# EasyEDA Pro project CustomDevKit.epro, schematic SimWheelKit_unified_REV2

## Sheets
1 CPU: Board Name: SimwheelKit_unified_REV2; Create Date: 2025-08-03; Page Name: CPU; Project Name: SimWheelKit_ESP32_unified; Schematic Name: SimWheelKit_unified_REV2; Update Date: 2025-08-04; Company: ESP32SimWheel; Drawn: Afpineda; Page Size: A4; Version: REV2
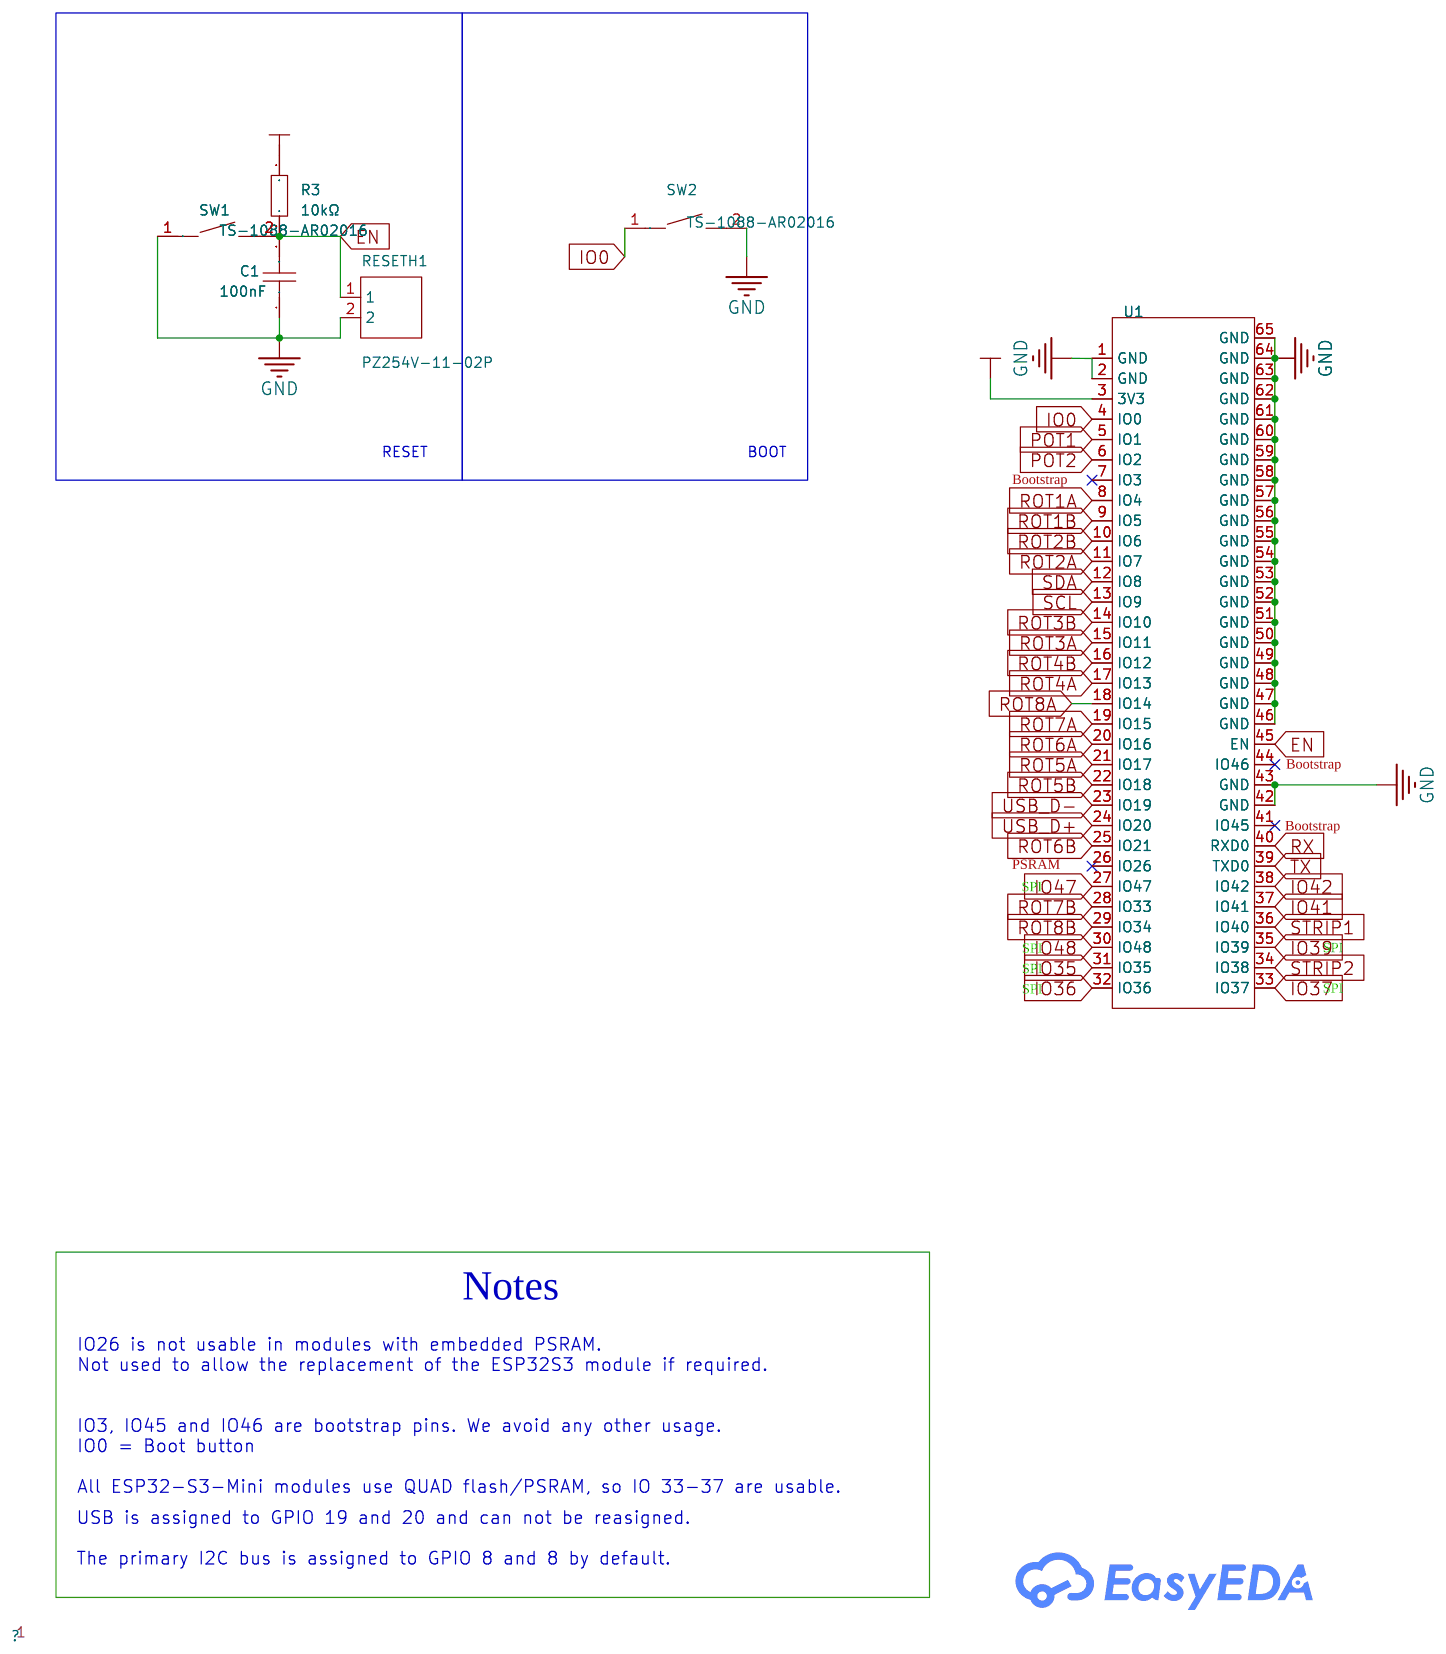
[diagram p0: CPU]
2 Connectors: Page Name: Connectors
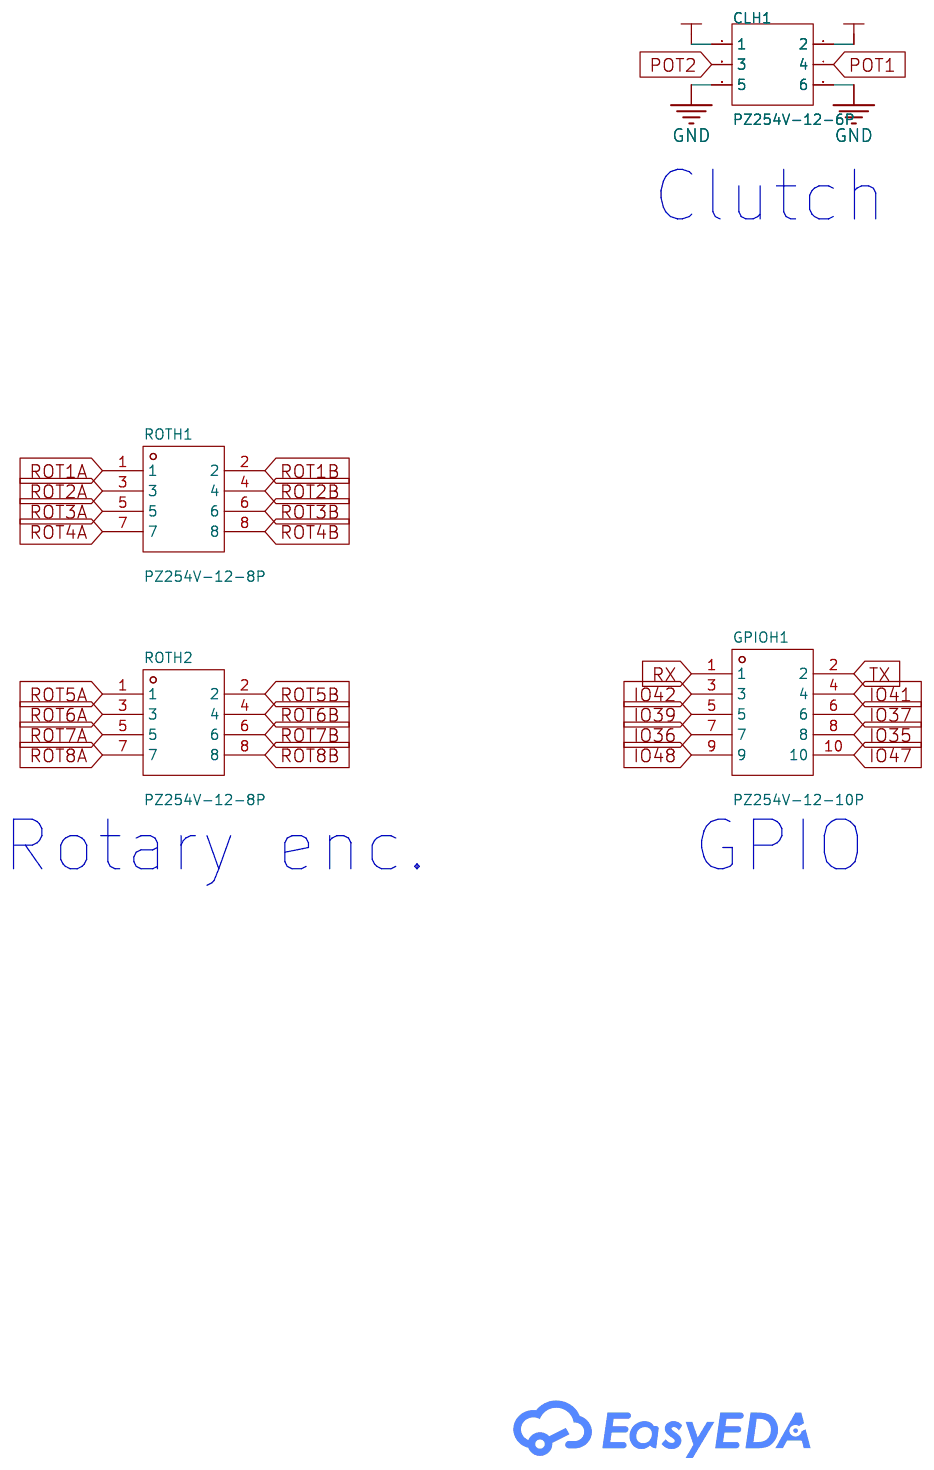
[diagram p1: Connectors]
3 Power: Page Name: Power
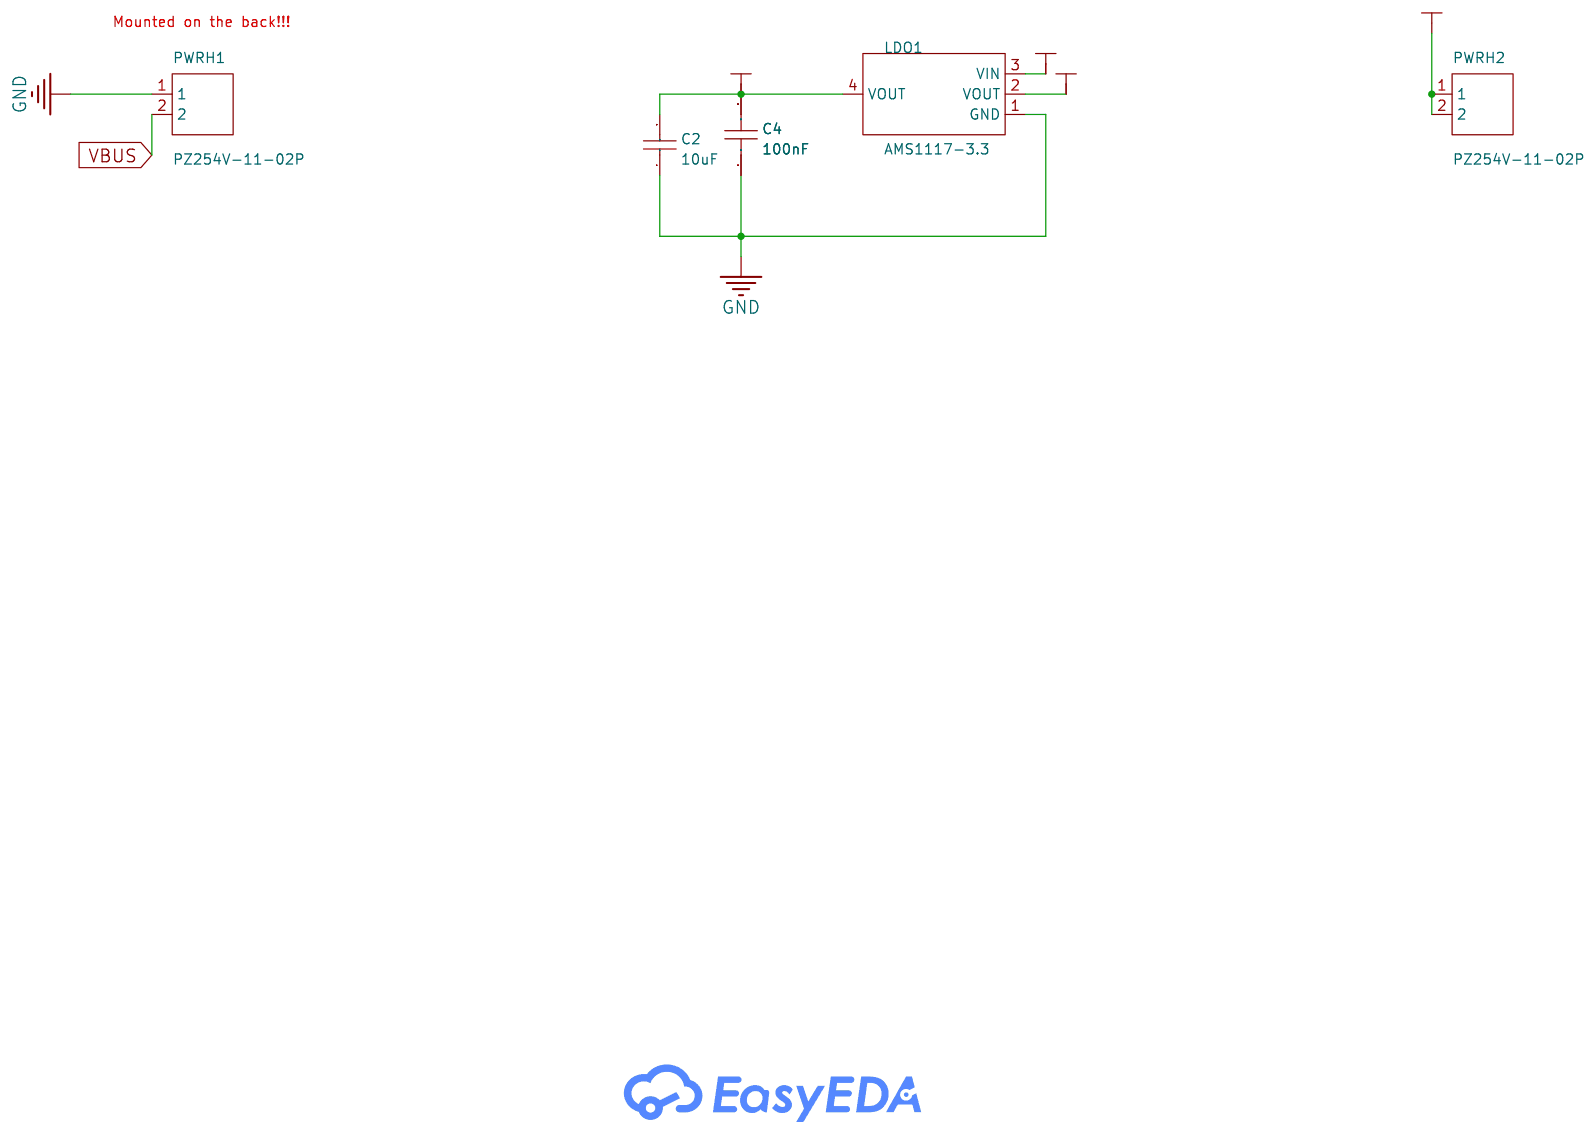
[diagram p2: Power]
4 LED strips: Page Name: LED strips; Company: EasyEDA.com
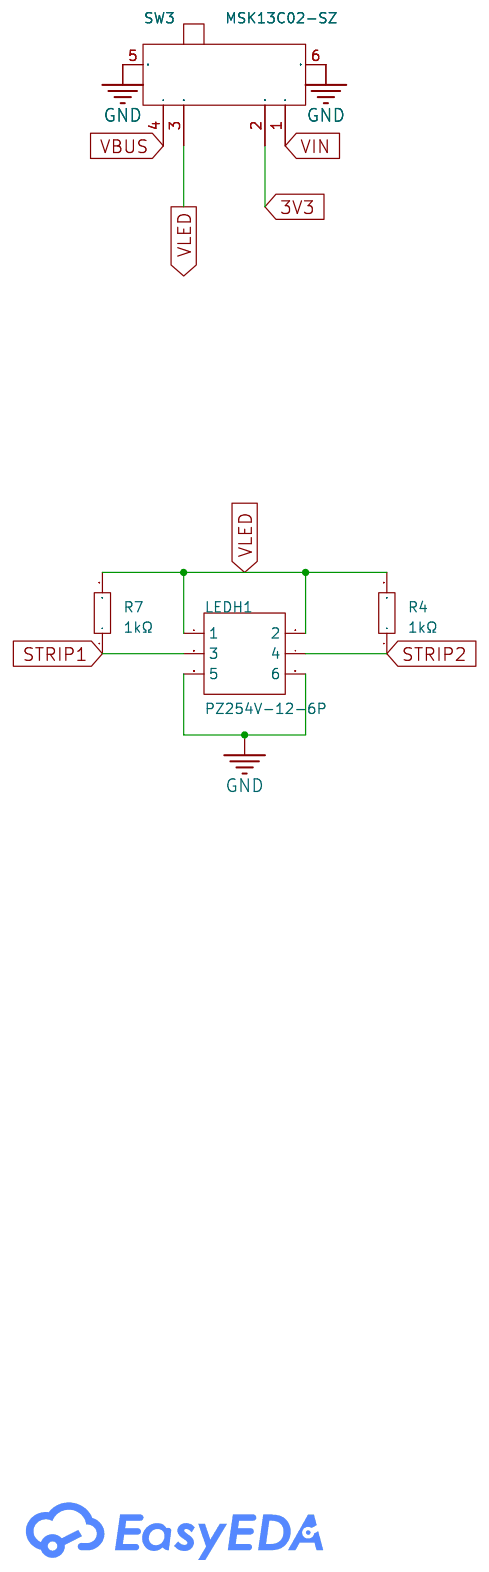
[diagram p3: LED strips]
5 USB: Page Name: USB; Update Date: 2025-08-03; Company: EasyEDA.com
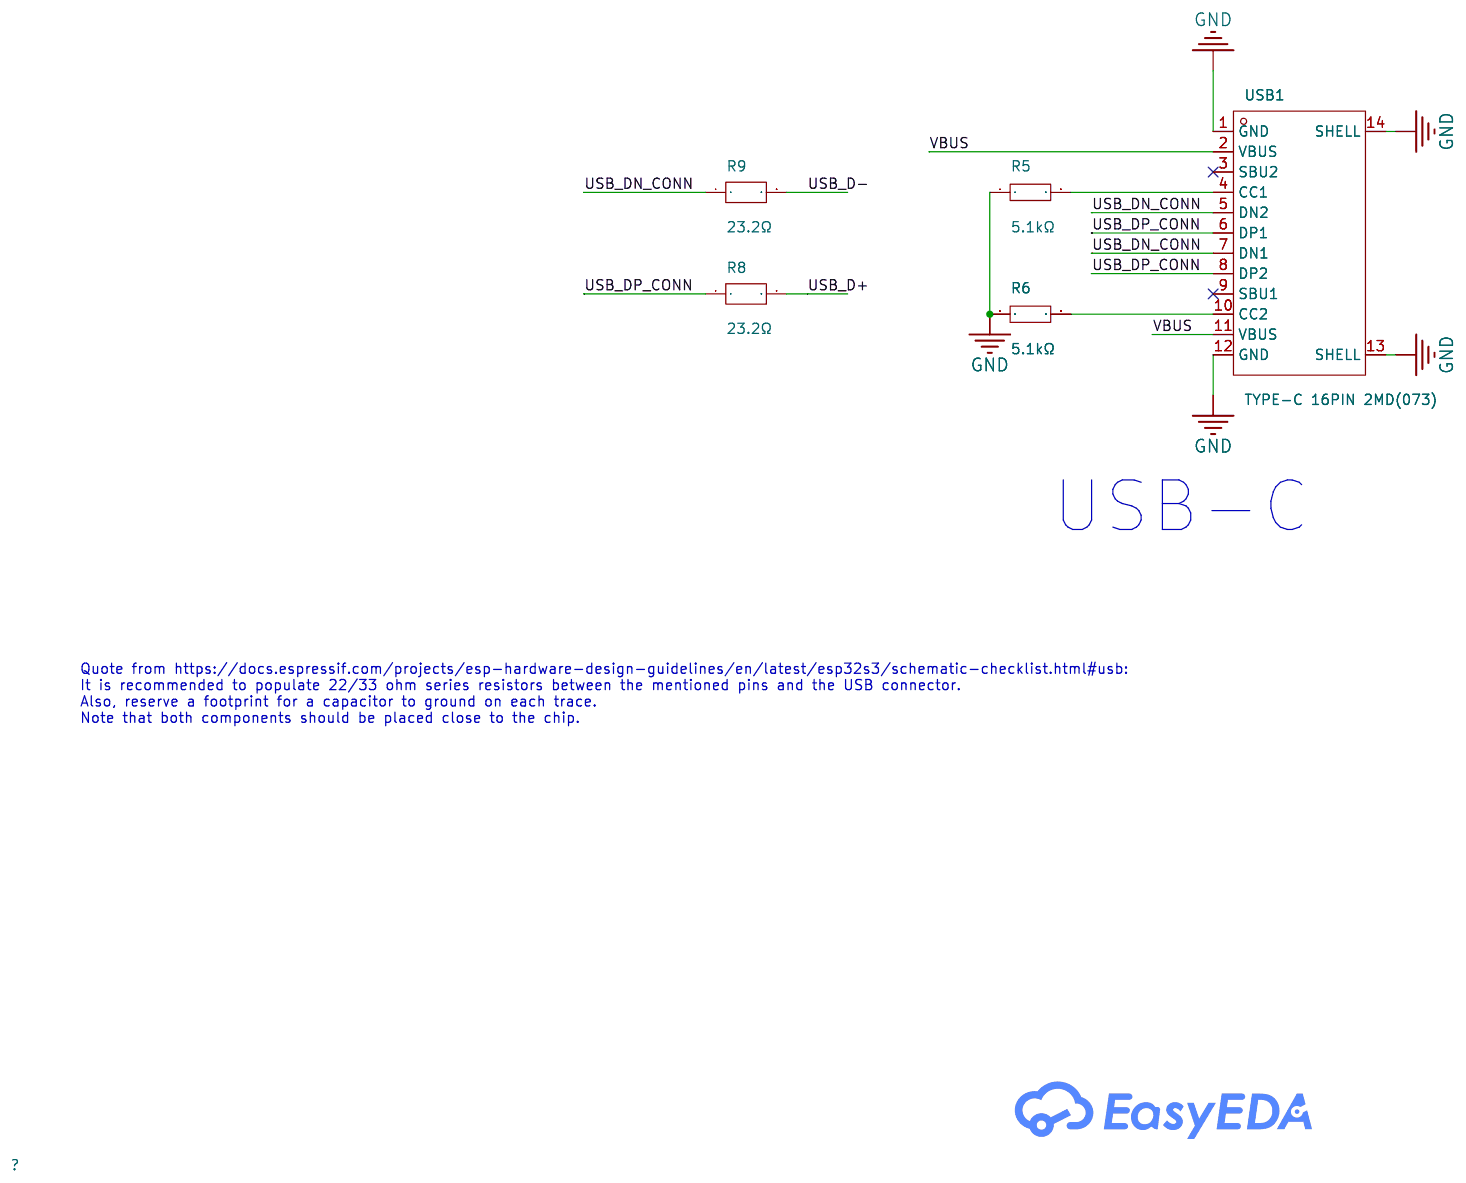
[diagram p4: USB]
6 Ground: Page Name: Ground; Update Date: 2025-08-20; Company: EasyEDA.com
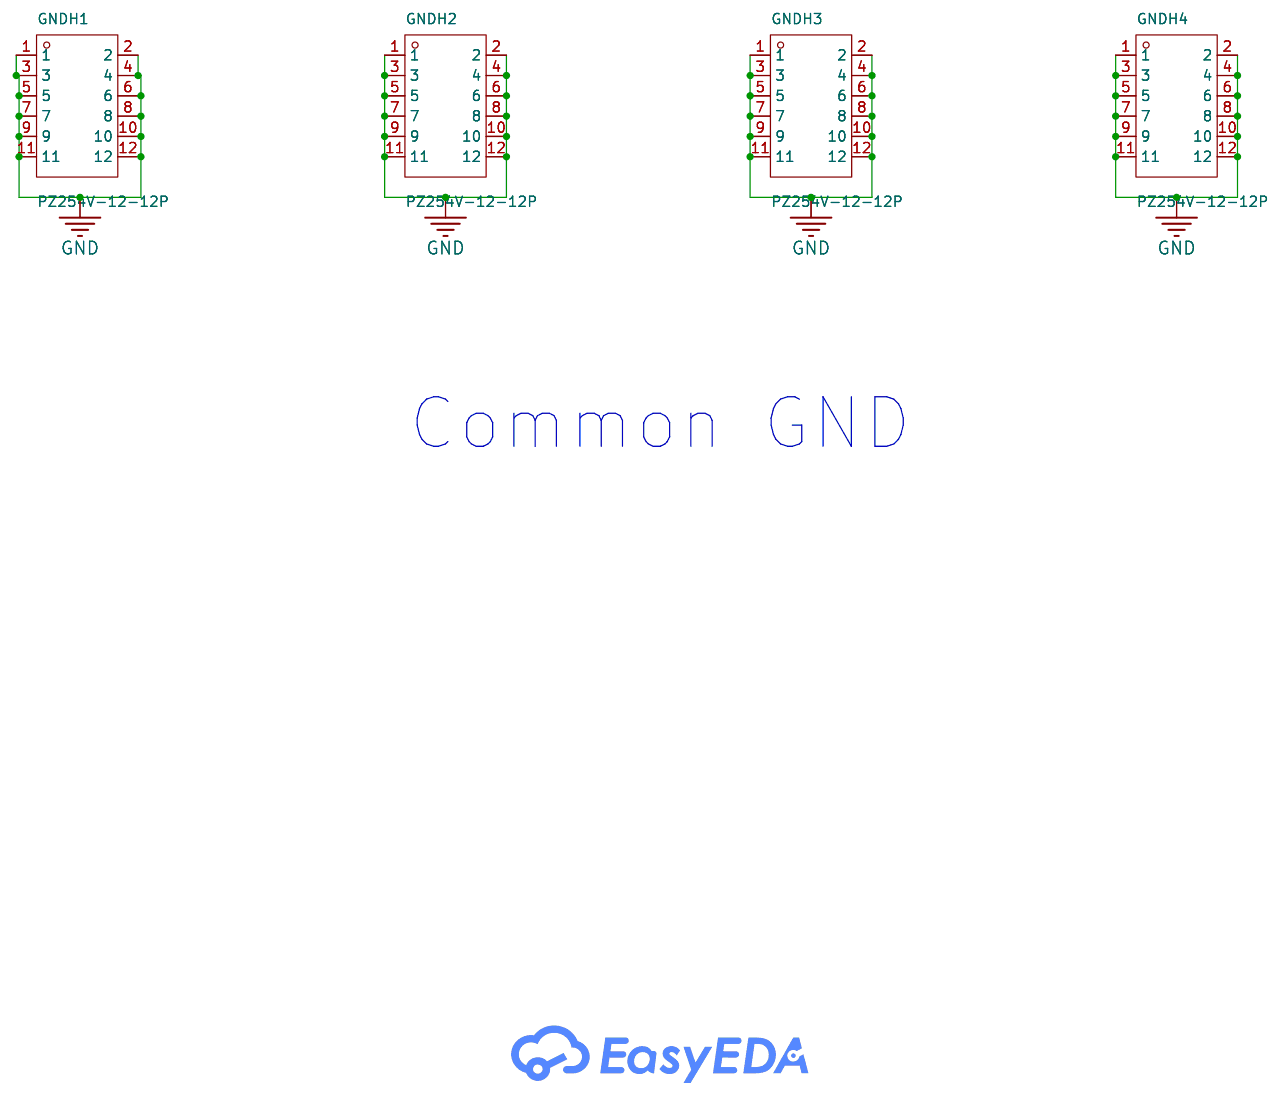
[diagram p5: Ground]
7 Battery: Page Name: Battery; Company: EasyEDA.com
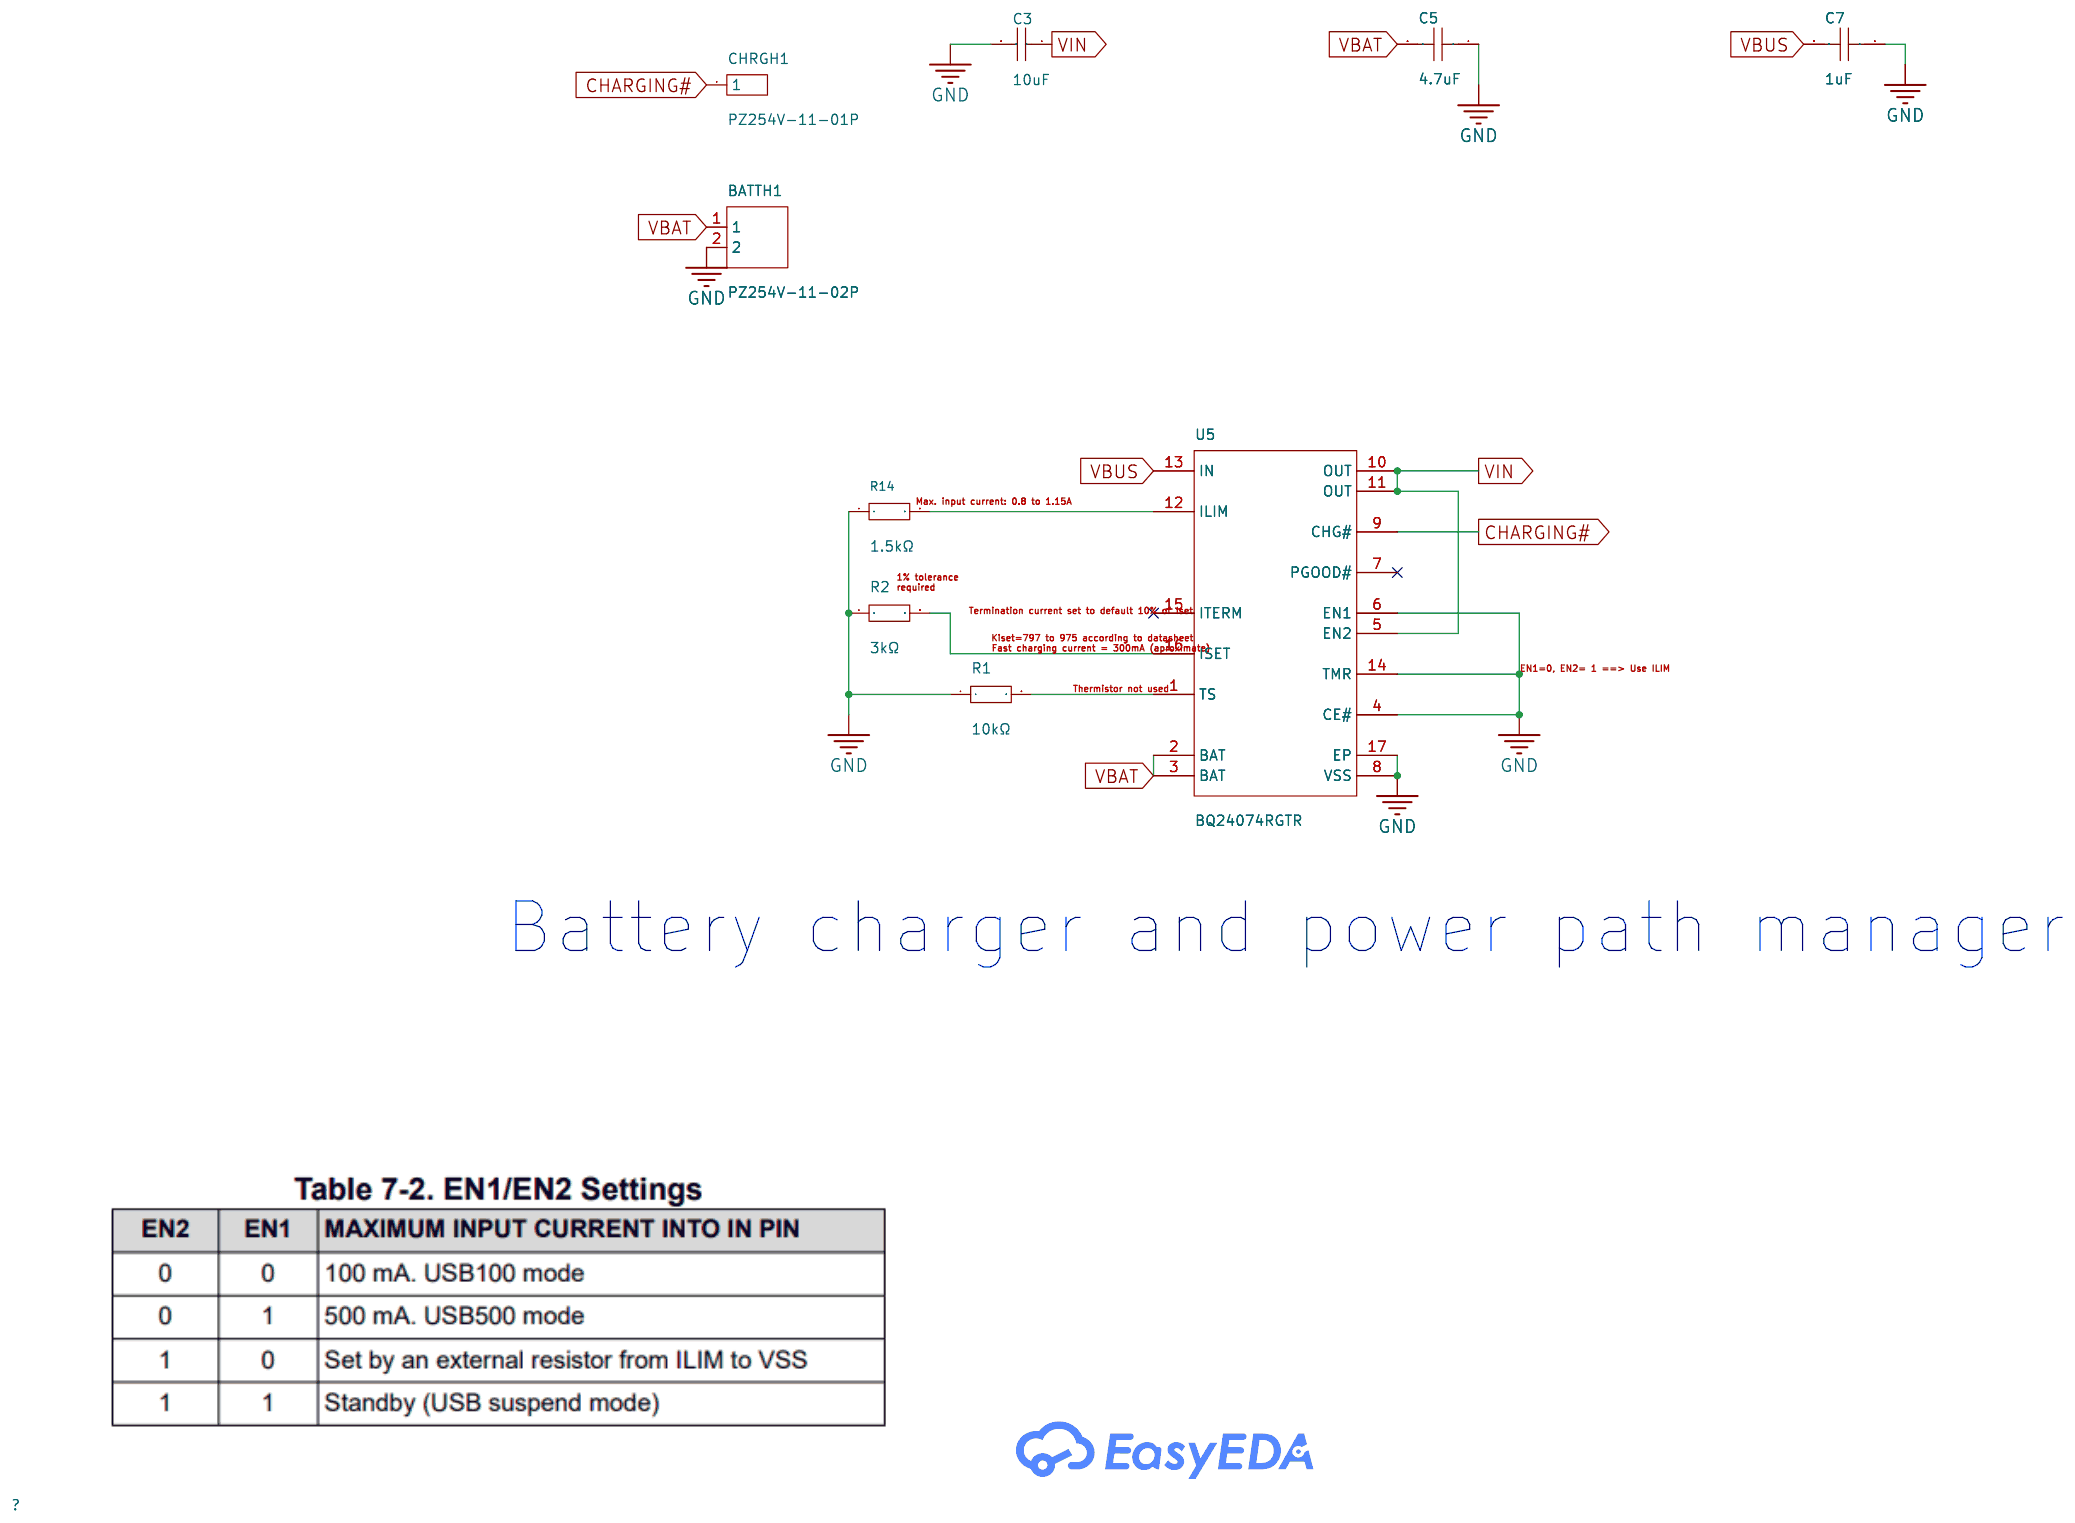
[diagram p6: Battery]
8 GPIOExpanders: Page Name: GPIOExpanders
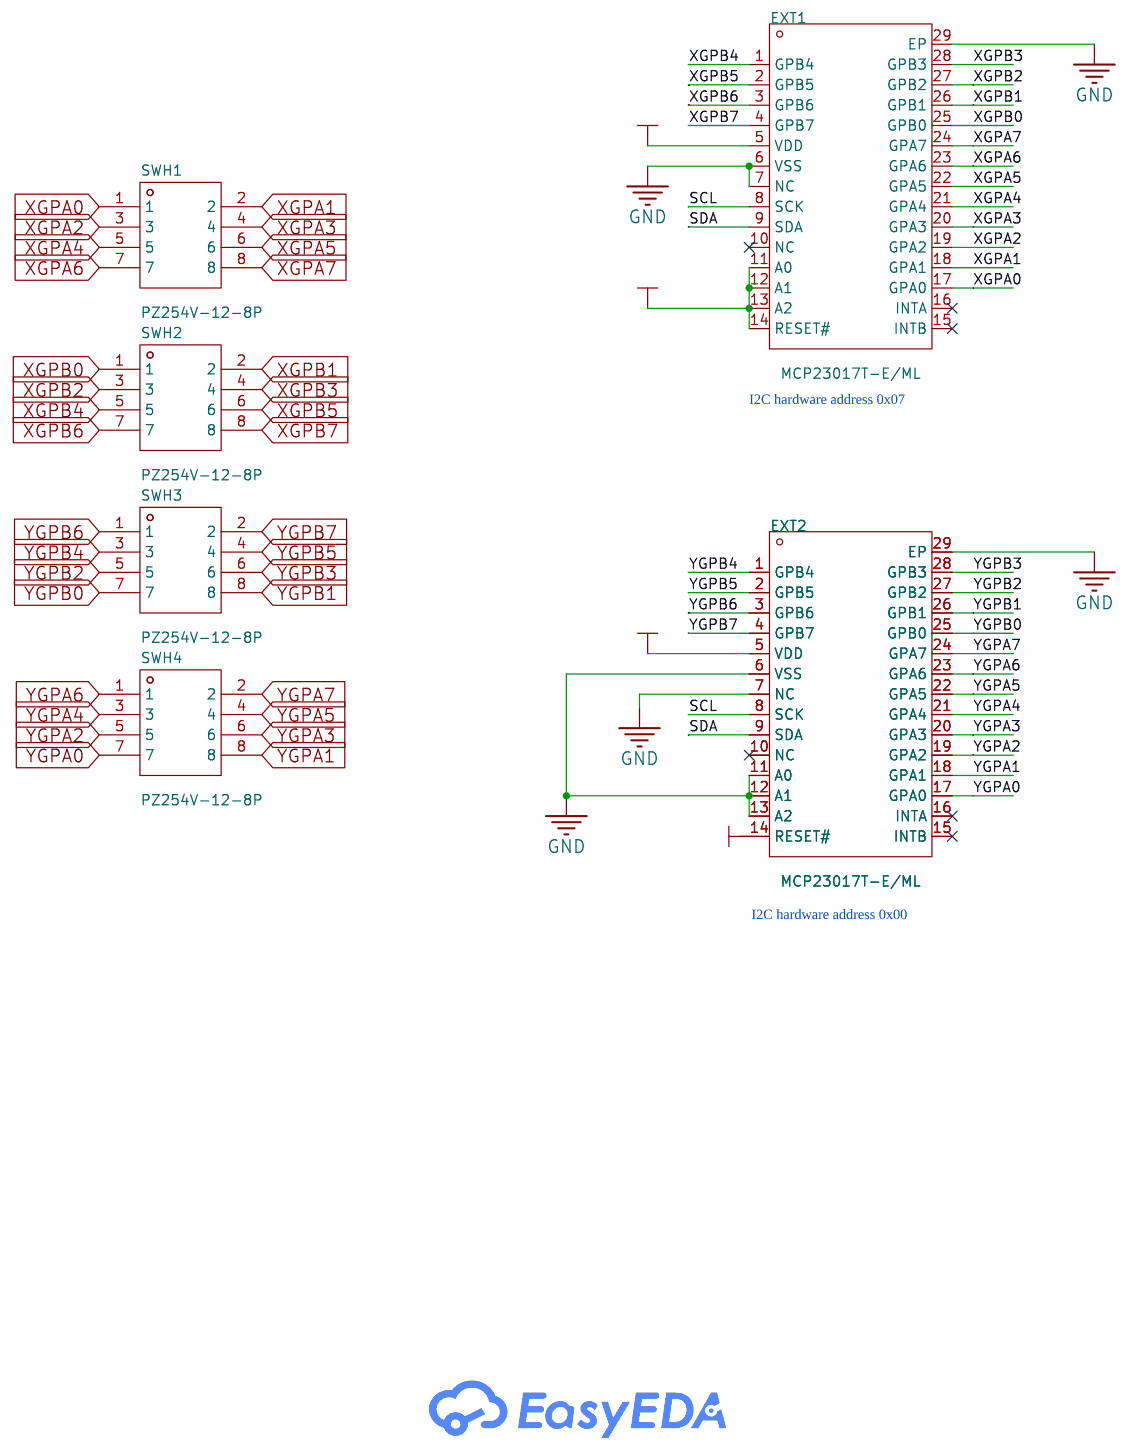
[diagram p7: GPIOExpanders]
9 Fuel Gauge: Page Name: Fuel Gauge; Update Date: 2025-08-03; Company: EasyEDA.com
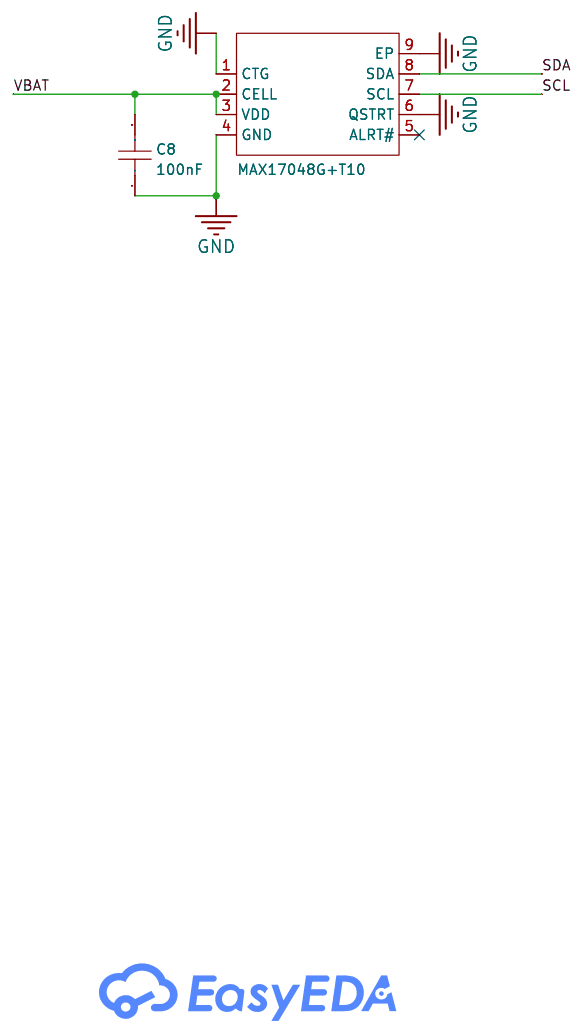
[diagram p8: Fuel Gauge]
10 I2C bus: Page Name: I2C bus; Update Date: 2025-08-03; Company: EasyEDA.com
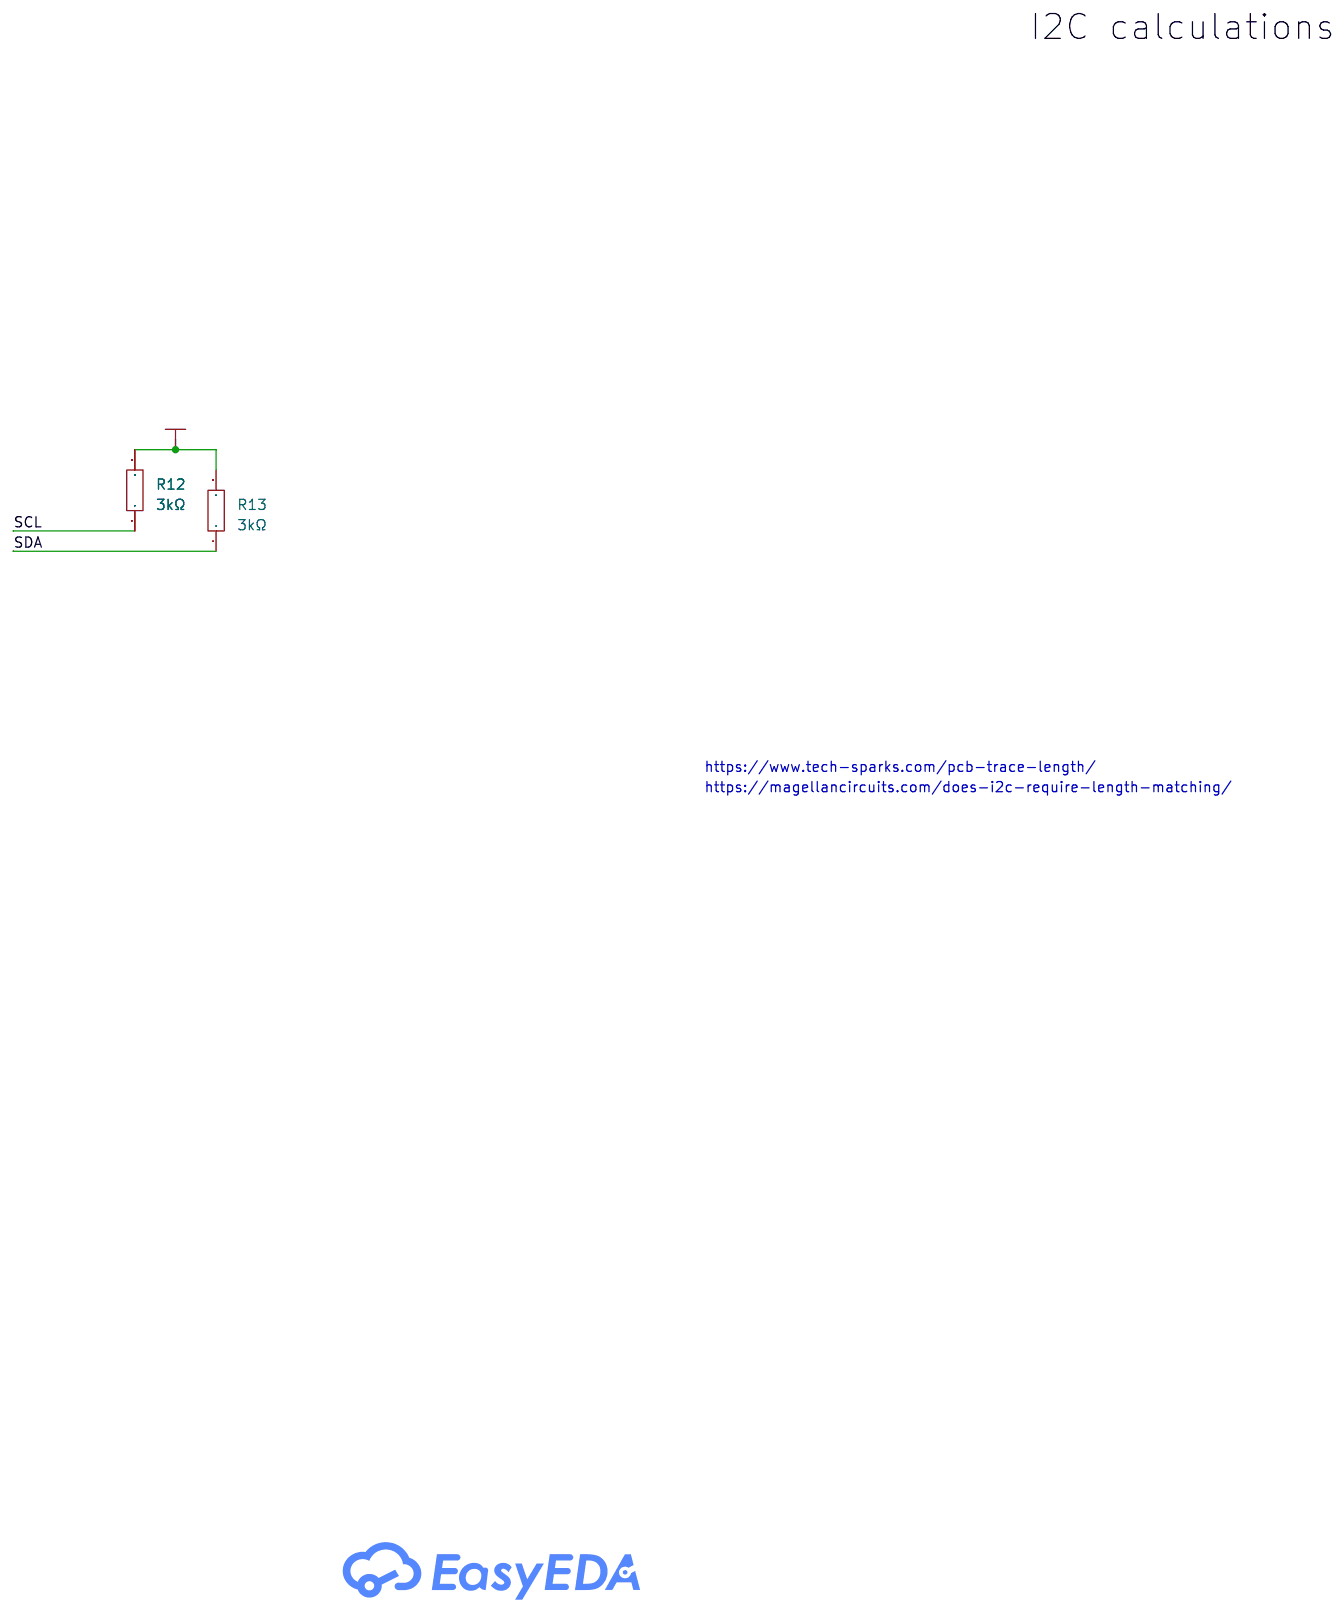
[diagram p9: I2C bus]

## Parts
sheet Battery
BATTH1  PZ254V-11-02P  [HDR-TH_2P-P2.54-V-M]  (no BOM)
C3  10uF  [C0402]
C5  4.7uF  [C0805]
C7  1uF  [C0402]
CHRGH1  PZ254V-11-01P  [HDR-TH_1P-P2.54-V-M]
R1  10kΩ  [R0402]
R2  3kΩ  [R0201]
R14  1.5kΩ  [R0402]
U5  BQ24074RGTR  [QFN-16_L3.0-W3.0-P0.50-TL-EP1.7]
sheet Connectors
CLH1  PZ254V-12-6P  [HDR-TH_6P-P2.54-V-M-R2-C3-S2.54]  (no BOM)
GPIOH1  PZ254V-12-10P  [HDR-TH_10P-P2.54-V-M-R2-C5-S2.54]  (no BOM)
ROTH1  PZ254V-12-8P  [HDR-TH_8P-P2.54-V-M-R2-C4-S2.54]  (no BOM)
ROTH2  PZ254V-12-8P  [HDR-TH_8P-P2.54-V-M-R2-C4-S2.54]  (no BOM)
sheet CPU
C1  100nF  [C0603]
R3  10kΩ  [R0402]
RESETH1  PZ254V-11-02P  [HDR-TH_2P-P2.54-V-M]  (no BOM)
SW1  TS-1088-AR02016  [SW-SMD_L3.9-W3.0-P4.45]
SW2  TS-1088-AR02016  [SW-SMD_L3.9-W3.0-P4.45]
U1  2.4GHz  [BULETM-SMD_ESPRESSIF_ESP32-S3-MINI-1U-N8]
sheet Fuel Gauge
C8  100nF  [C0402]
U4  MAX17048G+T10  [TDFN-8_L2.0-W2.0-P0.50-BL-EP1.2]
sheet GPIOExpanders
EXT1  MCP23017T-E/ML  [QFN-28_L6.0-W6.0-P0.65-BL-EP3.7]
EXT2  MCP23017T-E/ML  [QFN-28_L6.0-W6.0-P0.65-BL-EP3.7]
SWH1  PZ254V-12-8P  [HDR-TH_8P-P2.54-V-M-R2-C4-S2.54]  (no BOM)
SWH2  PZ254V-12-8P  [HDR-TH_8P-P2.54-V-M-R2-C4-S2.54]  (no BOM)
SWH3  PZ254V-12-8P  [HDR-TH_8P-P2.54-V-M-R2-C4-S2.54]  (no BOM)
SWH4  PZ254V-12-8P  [HDR-TH_8P-P2.54-V-M-R2-C4-S2.54]  (no BOM)
sheet Ground
GNDH1  PZ254V-12-12P  [HDR-TH_12P-P2.54-V-M-R2-C6-S2.54]  (no BOM)
GNDH2  PZ254V-12-12P  [HDR-TH_12P-P2.54-V-M-R2-C6-S2.54]  (no BOM)
GNDH3  PZ254V-12-12P  [HDR-TH_12P-P2.54-V-M-R2-C6-S2.54]  (no BOM)
GNDH4  PZ254V-12-12P  [HDR-TH_12P-P2.54-V-M-R2-C6-S2.54]  (no BOM)
sheet I2C bus
R12  3kΩ  [R0603]
R13  3kΩ  [R0603]
sheet LED strips
LEDH1  PZ254V-12-6P  [HDR-TH_6P-P2.54-V-M-R2-C3-S2.54]  (no BOM)
R4  1kΩ  [R0603]
R7  1kΩ  [R0603]
SW3  MSK13C02-SZ  [SW-SMD_MSK13C02-SZ]
sheet Power
C2  10uF  [C1206]
C4  100nF  [C0603]
LDO1  AMS1117-3.3  [SOT-223-3_L6.5-W3.4-P2.30-LS7.0-BR]
PWRH1  PZ254V-11-02P  [HDR-TH_2P-P2.54-V-M]  (no BOM)
PWRH2  PZ254V-11-02P  [HDR-TH_2P-P2.54-V-M]
sheet USB
R5  5.1kΩ  [R0402]
R6  5.1kΩ  [R0402]
R8  23.2Ω  [R0402]
R9  23.2Ω  [R0402]
USB1  TYPE-C 16PIN 2MD(073)  [USB-C-SMD_TYPE-C-6PIN-2MD-073]

## Library data of the parts
BATTH1 PWRH1 PWRH2 RESETH1 = PZ254V-11-02P: Pin Structure:1x2P Pitch:2.54mm Row Spacing:- Circluar Pins/Square Pins:Policy Mounting Type:Straight Number of Rows:Single Row Number of Pins:2P Current Rating:- Voltage Rating (Max):- Length of Mating Pin:6mm Insulation Height:2.5mm Length of End Connec; LCSC Part Name: 1x2P 间距:2.54mm 方针 直插; Supplier Part: C492401; Manufacturer: XFCN(兴飞); Supplier Footprint: 插件,P=2.54mm; JLCPCB Part Class: Extended Part; Datasheet: https://atta.szlcsc.com/upload/public/pdf/source/20200309/C492401_A812433581A9B211A7FFA413ADDFF0E5.pdf; Supplier: LCSC; Pin Structure: 1x2P; Pitch: 2.54mm; Circluar Pins/Square Pins: Policy; Mounting Type: Straight; Number of Rows: Single Row; Number of Pins: 2P; Length of Mating Pin: 6mm; Insulation Height: 2.5mm; Length of End Connection Pin: 3mm; Contact Material: Brass; Operating Temperature: -40℃~+105℃; Color: Black
C3 = CL05A106MQ5NUNC: Capacitance: Tolerance:±20% Tolerance:±20% Voltage Rated: Temperature Coefficient:; LCSC Part Name: 10uF ±20% 6.3V; Supplier Part: C15525; Manufacturer: SAMSUNG(三星); Supplier Footprint: 0402; JLCPCB Part Class: Basic Part; Datasheet: https://atta.szlcsc.com/upload/public/pdf/source/20220823/2B02EE04F8F211D38A52DCB16EB6BEBA.pdf; Supplier: LCSC; Tolerance: ±20%
C5 = CL21A475KAQNNNE: Capacitance: Tolerance:±10% Tolerance:±10% Voltage Rated: Temperature Coefficient:; LCSC Part Name: 4.7uF ±10% 25V; Supplier Part: C1779; Manufacturer: SAMSUNG(三星); Supplier Footprint: 0805; JLCPCB Part Class: Basic Part; Datasheet: https://atta.szlcsc.com/upload/public/pdf/source/20160218/1457707763339.pdf; Supplier: LCSC; Tolerance: ±10%
C7 = CL05A105KA5NQNC: Capacitance: Tolerance:±10% Tolerance:±10% Voltage Rated: Temperature Coefficient:; LCSC Part Name: 1uF ±10% 25V; Supplier Part: C52923; Manufacturer: SAMSUNG(三星); Supplier Footprint: 0402; JLCPCB Part Class: Basic Part; Datasheet: https://atta.szlcsc.com/upload/public/pdf/source/20160218/1457707763339.pdf; Supplier: LCSC; Tolerance: ±10%
CHRGH1 = PZ254V-11-01P: Pin Structure:1x1P Pitch:2.54mm Row Spacing:- Circluar Pins/Square Pins:Policy Mounting Type:Straight Number of Rows:Single Row Number of Pins:1P Current Rating:- Voltage Rating (Max):- Length of Mating Pin:6mm Insulation Height:2.5mm Length of End Connec; LCSC Part Name: 1x1P 间距:2.54mm 方针 直插; Supplier Part: C492400; Manufacturer: XFCN(兴飞); Supplier Footprint: 插件,P=2.54mm; JLCPCB Part Class: Extended Part; Datasheet: https://atta.szlcsc.com/upload/public/pdf/source/20200309/C492400_46876A5B545F5AE6B8D4A09C46E276E8.pdf; Supplier: LCSC; Pin Structure: 1x1P; Pitch: 2.54mm; Circluar Pins/Square Pins: Policy; Mounting Type: Straight; Number of Rows: Single Row; Number of Pins: 1P; Length of Mating Pin: 6mm; Insulation Height: 2.5mm; Length of End Connection Pin: 3mm; Contact Material: Brass; Operating Temperature: -40℃~+105℃; Color: Black
R1 R3 = 0402WGF1002TCE: Type:Thick Film Resistors Resistance:10kΩ Tolerance:±1% Tolerance:±1% Power(Watts): Overload Voltage (Max): Temperature Coefficient:±100ppm/℃ Temperature Coefficient:±100ppm/℃ Operating Temperature Range:-55℃~+155℃ Operating Temperature Range:-55℃~+155℃; LCSC Part Name: 10kΩ ±1% 62.5mW 厚膜电阻; Supplier Part: C25744; Manufacturer: UNI-ROYAL(厚声); Supplier Footprint: 0402; JLCPCB Part Class: Basic Part; Datasheet: https://atta.szlcsc.com/upload/public/pdf/source/20200306/C422600_1E6D84923E4A46A82E41ADD87F860B5C.pdf; Supplier: LCSC; Type: Thick Film Resistors; Tolerance: ±1%; Temperature Coefficient: ±100ppm/℃; Operating Temperature Range: -55℃~+155℃
R2 = 0201WMF3001TEE: Type:Thick Film Resistors Resistance:3kΩ Tolerance:±1% Tolerance:±1% Power(Watts): Overload Voltage (Max): Temperature Coefficient:±200ppm/℃ Temperature Coefficient:±200ppm/℃ Operating Temperature Range:-55℃~+155℃ Operating Temperature Range:-55℃~+155℃; LCSC Part Name: 3kΩ ±1% 50mW 厚膜电阻; Supplier Part: C473468; Manufacturer: UNI-ROYAL(厚声); Supplier Footprint: 0201; JLCPCB Part Class: Extended Part; Datasheet: https://atta.szlcsc.com/upload/public/pdf/source/20200306/C422600_1E6D84923E4A46A82E41ADD87F860B5C.pdf; Supplier: LCSC; Type: Thick Film Resistors; Tolerance: ±1%; Temperature Coefficient: ±200ppm/℃; Operating Temperature Range: -55℃~+155℃
R14 = 0402WGF1501TCE: Type:Thick Film Resistors Resistance:1.5kΩ Tolerance:±1% Tolerance:±1% Power(Watts): Overload Voltage (Max): Temperature Coefficient:±100ppm/℃ Temperature Coefficient:±100ppm/℃ Operating Temperature Range:-55℃~+155℃ Operating Temperature Range:-55℃~+155℃; LCSC Part Name: 1.5kΩ ±1% 62.5mW 厚膜电阻; Supplier Part: C25867; Manufacturer: UNI-ROYAL(厚声); Supplier Footprint: 0402; JLCPCB Part Class: Basic Part; Datasheet: https://atta.szlcsc.com/upload/public/pdf/source/20200306/C422600_1E6D84923E4A46A82E41ADD87F860B5C.pdf; Supplier: LCSC; Type: Thick Film Resistors; Tolerance: ±1%; Temperature Coefficient: ±100ppm/℃; Operating Temperature Range: -55℃~+155℃
U5 = BQ24074RGTR: The Chip Type:- Voltage - Supply:4.35V~26V Voltage - Supply:4.35V~26V Charge Current - Max:- Charging Saturation Voltage:4.2V Type of Battery:Lithium-ion/Polymer Number of Cells:1 Number of Cells:1 Operating Temperature:-40℃~+85℃ Operating Temperature:-40; LCSC Part Name: USB友好型1.5A锂离子电池充电器和电源路径管理IC; Supplier Part: C54313; Manufacturer: TI(德州仪器); Supplier Footprint: QFN-16-EP(3x3); JLCPCB Part Class: Extended Part; Datasheet: https://www.ti.com/cn/lit/gpn/bq24074; Supplier: LCSC; Voltage - Supply: 4.35V~26V; Charging Saturation Voltage: 4.2V; Type of Battery: Lithium-ion/Polymer; Number of Cells: 1; Operating Temperature: -40℃~+85℃
CLH1 LEDH1 = PZ254V-12-6P: Pin Structure:2x3P Pitch:2.54mm Row Spacing:2.54mm Circluar Pins/Square Pins:Square Pins Mounting Type:Straight Number of Rows:双排 Number of Pins:6P Current Rating (Max):- Voltage Rating (Max):- Length of Mating Pin:6mm Insulation Height:2.5mm Length of En; LCSC Part Name: 间距:2.54mm 2x3P 直插 方针; Supplier Part: C492420; Manufacturer: XFCN(兴飞); Supplier Footprint: 插件,P=2.54mm; JLCPCB Part Class: Extended Part; Datasheet: https://atta.szlcsc.com/upload/public/pdf/source/20200309/C492420_BAECB307B001054C09D200388220EAE6.pdf; Supplier: LCSC; Pin Structure: 2x3P; Pitch: 2.54mm; Row Spacing: 2.54mm; Circluar Pins/Square Pins: Square Pins; Mounting Type: Straight; Number of Rows: 双排; Number of Pins: 6P; Length of Mating Pin: 6mm; Insulation Height: 2.5mm; Length of End Connection Pin: 3mm; Operating Temperature Range: -40℃~+105℃; Color: Black
GPIOH1 = PZ254V-12-10P: Pin Structure:2x5P Pitch:2.54mm Row Spacing:2.54mm Circluar Pins/Square Pins:Policy Mounting Type:Straight Number of Rows:Double Row Number of Pins:10P Current Rating:- Voltage Rating (Max):- Length of Mating Pin:6mm Insulation Height:2.5mm Length of End; LCSC Part Name: 2x5P 间距:2.54mm 方针 直插; Supplier Part: C492422; Manufacturer: XFCN(兴飞); Supplier Footprint: 插件,P=2.54mm; JLCPCB Part Class: Extended Part; Datasheet: https://atta.szlcsc.com/upload/public/pdf/source/20200309/C492422_5020CEA01BE7051F9EA9DD81AB0A25E3.pdf; Supplier: LCSC; Pin Structure: 2x5P; Pitch: 2.54mm; Row Spacing: 2.54mm; Circluar Pins/Square Pins: Policy; Mounting Type: Straight; Number of Rows: Double Row; Number of Pins: 10P; Length of Mating Pin: 6mm; Insulation Height: 2.5mm; Length of End Connection Pin: 3mm; Contact Material: Brass; Operating Temperature: -40℃~+105℃; Color: Black
ROTH1 ROTH2 SWH1-SWH4 = PZ254V-12-8P: Pin Structure:2x4P Pitch:2.54mm Row Spacing:2.54mm Circluar Pins/Square Pins:Policy Mounting Type:Straight Number of Rows:Double Row Number of Pins:8P Current Rating:- Voltage Rating (Max):- Length of Mating Pin:6mm Insulation Height:2.5mm Length of End C; LCSC Part Name: 2x4P 间距:2.54mm 方针 直插; Supplier Part: C492421; Manufacturer: XFCN(兴飞); Supplier Footprint: 插件,P=2.54mm; JLCPCB Part Class: Extended Part; Datasheet: https://atta.szlcsc.com/upload/public/pdf/source/20200309/C492421_DC8A206AF99CD7755BD4A5B0BC48200B.pdf; Supplier: LCSC; Pin Structure: 2x4P; Pitch: 2.54mm; Row Spacing: 2.54mm; Circluar Pins/Square Pins: Policy; Mounting Type: Straight; Number of Rows: Double Row; Number of Pins: 8P; Length of Mating Pin: 6mm; Insulation Height: 2.5mm; Length of End Connection Pin: 3mm; Contact Material: Brass; Operating Temperature: -40℃~+105℃; Color: Black
C1 = CC0603KRX7R9BB104: Capacitance:100nF Tolerance:±10% Tolerance:±10% Voltage Rating:50V Temperature Coefficient:X7R; LCSC Part Name: 100nF ±10% 50V; Supplier Part: C14663; Manufacturer: YAGEO(国巨); Supplier Footprint: 0603; JLCPCB Part Class: Basic Part; Datasheet: https://atta.szlcsc.com/upload/public/pdf/source/20250214/096C4C206003071F5D32E5F0D8E7F8DF.pdf; Supplier: LCSC; Tolerance: ±10%; Voltage Rating: 50V; Temperature Coefficient: X7R
SW1 SW2 = TS-1088-AR02016: Circuit:SPST Actuator Style:Round Button Operating Force:160gf Mounting Style:Brick nogging Switch Length:4mm Switch Width:3mm Switch Height:2mm Strike Gundam:不带 Contact Current:50mA Voltage Rating (DC):12V Insulation Resistance:100MΩ Actuator/Cap Color:B; LCSC Part Name: 4*3*2mm 立贴 轻触开关; Supplier Part: C720477; Manufacturer: XUNPU(讯普); Supplier Footprint: SMD; JLCPCB Part Class: Basic Part; Datasheet: https://atta.szlcsc.com/upload/public/pdf/source/20200810/C720475_60D09DD6C54279ADDB2DC25100F1CC11.pdf; Supplier: LCSC; Circuit: SPST; Actuator Style: Round Button; Operating Force: 160gf; Mounting Style: Brick nogging; Switch Length: 4mm; Switch Width: 3mm; Switch Height: 2mm; Strike Gundam: 不带; Contact Current: 50mA; Voltage Rating (DC): 12V; Insulation Resistance: 100MΩ; Actuator/Cap Color: Black; Pin Style: SMDSplicing; Mechanical Life: 10万次; Operating Temperature: -30℃~+80℃; Check: true
U1 = ESP32-S3-MINI-1U-N8: Support Interface:I2C；GPIO；PCM；PWM；SPI；IrDA；JTAG；SDIO；UART；I2S Frequency:2.4GHz Output Power:21dBm Output Power:21dBm; Supplier Part: C2980299; Manufacturer: ESPRESSIF(乐鑫); Supplier Footprint: VFQFN-56-EP; JLCPCB Part Class: Extended Part; Datasheet: https://atta.szlcsc.com/upload/public/pdf/source/20241030/DBA982A824F8AE095D7F5EE20376AD45.pdf; Supplier: LCSC; Support Interface: I2C；GPIO；PCM；PWM；SPI；IrDA；JTAG；SDIO；UART；I2S; Output Power: 21dBm
C8 = CL05B104KO5NNNC: Capacitance: Tolerance:±10% Tolerance:±10% Voltage Rated: Temperature Coefficient:; LCSC Part Name: 100nF ±10% 16V; Supplier Part: C1525; Manufacturer: SAMSUNG(三星); Supplier Footprint: 0402; JLCPCB Part Class: Basic Part; Datasheet: https://atta.szlcsc.com/upload/public/pdf/source/20160218/1457707763339.pdf; Supplier: LCSC; Tolerance: ±10%
U4 = MAX17048G+T10: The Chip Type:Battery monitoring chip Voltage - Supply:2.5V~4.5V Voltage - Supply:2.5V~4.5V Type of Battery:Lithium-ion/Polymer Number of Cells:1 Number of Cells:1 Operating Temperature:-40℃~+85℃ Operating Temperature:-40℃~+85℃; LCSC Part Name: 单节/双节电池电量计使用ModelGauge技术; Supplier Part: C2682616; Manufacturer: ADI(亚德诺)/MAXIM(美信); Supplier Footprint: DFN-8-EP(2x2); JLCPCB Part Class: Extended Part; Datasheet: https://atta.szlcsc.com/upload/public/pdf/source/20210106/C2682616_818568B5D3BA4B627110FCAA33E0BFB1.pdf; Supplier: LCSC; The Chip Type: Battery monitoring chip; Voltage - Supply: 2.5V~4.5V; Type of Battery: Lithium-ion/Polymer; Number of Cells: 1; Operating Temperature: -40℃~+85℃
EXT1 EXT2 = MCP23017T-E/ML: Interface:- Number of I/O:16 Interrupt Output:With Interrupt Output Output Type:- Voltage - Supply:1.8V~5.5V Voltage - Supply:1.8V~5.5V Current - Output Low(IOL):- Current - Output High(IOH):- Clock Frequency:- Operating Temperature:-40℃~+125℃ Operating T; LCSC Part Name: 16位带串行接口的I/O扩展器; Supplier Part: C629439; Manufacturer: MICROCHIP(美国微芯); Supplier Footprint: QFN-28-EP(6x6); JLCPCB Part Class: Extended Part; Datasheet: https://atta.szlcsc.com/upload/public/pdf/source/20221209/1BF939F88C2D907BC056D7BF485E3103.pdf; Supplier: LCSC; Number of I/O: 16; Interrupt Output: With Interrupt Output; Voltage - Supply: 1.8V~5.5V; Operating Temperature: -40℃~+125℃
GNDH1-GNDH4 = PZ254V-12-12P: Pin Structure:2x6P Pitch:2.54mm Row Spacing:2.54mm Circluar Pins/Square Pins:Policy Mounting Type:Straight Number of Rows:Double Row Number of Pins:12P Current Rating:- Voltage Rating (Max):- Length of Mating Pin:6mm Insulation Height:2.5mm Length of End; LCSC Part Name: 2x6P 间距:2.54mm 方针 直插; Supplier Part: C492423; Manufacturer: XFCN(兴飞); Supplier Footprint: 插件,P=2.54mm; JLCPCB Part Class: Extended Part; Datasheet: https://atta.szlcsc.com/upload/public/pdf/source/20200309/C492423_E4E2C9BC0EB9D59A2ABE4377D2E234B2.pdf; Supplier: LCSC; Pin Structure: 2x6P; Pitch: 2.54mm; Row Spacing: 2.54mm; Circluar Pins/Square Pins: Policy; Mounting Type: Straight; Number of Rows: Double Row; Number of Pins: 12P; Length of Mating Pin: 6mm; Insulation Height: 2.5mm; Length of End Connection Pin: 3mm; Contact Material: Brass; Operating Temperature: -40℃~+105℃; Color: Black
R12 R13 = 0603WAF3001T5E: Type:Thick Film Resistors Resistance:3kΩ Tolerance:±1% Tolerance:±1% Power(Watts):0.1W Voltage-Supply(Max):75V Temperature Coefficient:±100ppm/℃ Temperature Coefficient:±100ppm/℃ Operating Temperature:-55℃~+155℃ Operating Temperature:-55℃~+155℃; LCSC Part Name: 3kΩ ±1% 100mW 厚膜电阻; Supplier Part: C4211; Manufacturer: UNI-ROYAL(厚声); Supplier Footprint: 0603; JLCPCB Part Class: Basic Part; Datasheet: https://atta.szlcsc.com/upload/public/pdf/source/20200306/C422600_1E6D84923E4A46A82E41ADD87F860B5C.pdf; Supplier: LCSC; Type: Thick Film Resistors; Tolerance: ±1%; Power(Watts): 0.1W; Voltage-Supply(Max): 75V; Temperature Coefficient: ±100ppm/℃; Operating Temperature: -55℃~+155℃
R4 R7 = RC0603FR-071KL: Type:Thick Film Resistors Resistance:1kΩ Tolerance:±1% Tolerance:±1% Power(Watts):100mW Voltage-Supply(Max):75V Temperature Coefficient:±100ppm/℃ Temperature Coefficient:±100ppm/℃ Operating Temperature:-55℃~+155℃ Operating Temperature:-55℃~+155℃; LCSC Part Name: 厚膜电阻 1kΩ ±1% 100mW; Supplier Part: C22548; Manufacturer: YAGEO(国巨); Supplier Footprint: 0603; JLCPCB Part Class: Extended Part; Datasheet: https://atta.szlcsc.com/upload/public/pdf/source/20180316/70C0E2BDAE7FCC62C531A5A58D202EE1.pdf; Supplier: LCSC; Type: Thick Film Resistors; Tolerance: ±1%; Power(Watts): 100mW; Voltage-Supply(Max): 75V; Temperature Coefficient: ±100ppm/℃; Operating Temperature: -55℃~+155℃
SW3 = MSK13C02-SZ: Circuit:triple-pole/single-throw Actuator Style:- Pin Style:SMDSplicing Switch Length:9.9mm Switch Width:2.7mm Switch Height:1.5mm Mounting Style:卧贴 Actuator Color:- Current Rating (DC):100mA Voltage Rating (DC):12V Current Rating (AC):- Voltage Rating (A; LCSC Part Name: 贴片拨动/三档侧拨 8脚拨动 黑柄，柄长1.5mm,耐温袋装，高品质; Supplier Part: C2681569; Manufacturer: SHOU HAN(首韩); Supplier Footprint: SMD; JLCPCB Part Class: Extended Part; Datasheet: https://atta.szlcsc.com/upload/public/pdf/source/20231031/C8BED455619FEEF308EBA39F2FB3EDEE.pdf; Supplier: LCSC; Circuit: triple-pole/single-throw; Pin Style: SMDSplicing; Switch Length: 9.9mm; Switch Width: 2.7mm; Switch Height: 1.5mm; Mounting Style: 卧贴; Current Rating (DC): 100mA; Voltage Rating (DC): 12V; Mechanical Life: 1万次; Operating Temperature: -25℃~+70℃
C2 = CL31A106KBHNNNE: Capacitance: Tolerance:±10% Tolerance:±10% Voltage Rated: Temperature Coefficient:; LCSC Part Name: 10uF ±10% 50V; Supplier Part: C13585; Manufacturer: SAMSUNG(三星); Supplier Footprint: 1206; JLCPCB Part Class: Basic Part; Datasheet: https://atta.szlcsc.com/upload/public/pdf/source/20160218/1457707763339.pdf; Supplier: LCSC; Tolerance: ±10%; Check: true
C4 = CC0603KRX7R9BB104: Capacitance:100nF Tolerance:±10% Tolerance:±10% Voltage Rating:50V Temperature Coefficient:X7R; LCSC Part Name: 100nF ±10% 50V; Supplier Part: C14663; Manufacturer: YAGEO(国巨); Supplier Footprint: 0603; JLCPCB Part Class: Basic Part; Datasheet: https://atta.szlcsc.com/upload/public/pdf/source/20180910/C282072_33301C7F631E79921B82A8DAC6BCC5B3.pdf; Supplier: LCSC; Tolerance: ±10%; Voltage Rating: 50V; Temperature Coefficient: X7R; Check: true
LDO1 = AMS1117-3.3_C6186: Output Type:Fixed Voltage - Supply:16V Output Voltage:3.3V Output Voltage:3.3V Output Current:1A Power Supply Rejection Ratio (PSRR):72dB@(120Hz) Voltage Dropout:1.1V@(800mA) standby current:5mA Noise:- Features:Over Current Protection；Over Temperature Pr; LCSC Part Name: 输出3.3V 1A; Supplier Part: C6186; Manufacturer: AMS; Supplier Footprint: SOT-223; JLCPCB Part Class: Basic Part; Datasheet: https://atta.szlcsc.com/upload/public/pdf/source/20180727/C6186_7A095716F0823C02F1997A905E26C086.pdf; Supplier: LCSC; Output Type: Fixed; Voltage - Supply: 16V; Output Voltage: 3.3V; Output Current: 1A; Power Supply Rejection Ratio (PSRR): 72dB@(120Hz); Voltage Dropout: 1.1V@(800mA); standby current: 5mA; Features: Over Current Protection；Over Temperature Protection; Operating Temperature: -40℃~+125℃; Output Configuration: Positive; Number of Outputs: 1
R5 R6 = 0402WGF5101TCE: Type:Thick Film Resistor Resistance:5.1kΩ Tolerance:±1% Tolerance:±1% Power(Watts):62.5mW Voltage-Supply(Max):50V Temperature Coefficient:±100ppm/℃ Temperature Coefficient:±100ppm/℃ Operating Temperature:-55℃~+155℃ Operating Temperature:-55℃~+155℃; LCSC Part Name: 5.1kΩ ±1% 62.5mW 厚膜电阻; Supplier Part: C25905; Manufacturer: UNI-ROYAL(厚声); Supplier Footprint: 0402; JLCPCB Part Class: Basic Part; Datasheet: https://atta.szlcsc.com/upload/public/pdf/source/20200306/C422600_1E6D84923E4A46A82E41ADD87F860B5C.pdf; Supplier: LCSC; Type: Thick Film Resistor; Tolerance: ±1%; Power(Watts): 62.5mW; Temperature Coefficient: ±100ppm/℃; Operating Temperature Range: -55℃~+155℃; Voltage-Supply(Max): 50V; Operating Temperature: -55℃~+155℃
R8 R9 = RC0402FR-0723R2L: Type:Thick Film Resistors Resistance: Tolerance:±1% Tolerance:±1% Power(Watts): Overload Voltage (Max): Temperature Coefficient:±100ppm/℃ Temperature Coefficient:±100ppm/℃ Operating Temperature Range:-55℃~+155℃ Operating Temperature Range:-55℃~+155℃; LCSC Part Name: 厚膜电阻 23.2Ω ±1% 62.5mW; Supplier Part: C477676; Manufacturer: YAGEO(国巨); Supplier Footprint: 0402; JLCPCB Part Class: Extended Part; Datasheet: https://atta.szlcsc.com/upload/public/pdf/source/20200715/C477676_BC70BD85E92D28D9389FBE14E817996A.pdf; Supplier: LCSC; Type: Thick Film Resistors; Tolerance: ±1%; Temperature Coefficient: ±100ppm/℃; Operating Temperature Range: -55℃~+155℃
USB1 = TYPE-C 16PIN 2MD(073): Connector Type:Type-C Protocol Standard:USB 3.1 Gender:Female Mounting Type:Surface Mount, Right Angle Number of Contacts:16P Number of Ports:1 Current Rating-Power:3A Voltage Rating:5V Connect-Disconnect Life:5,000 Cycles Supplementary Features:- Center; LCSC Part Name: Type-C 母 卧贴; Supplier Part: C2765186; Manufacturer: SHOU HAN(首韩); Supplier Footprint: SMD; JLCPCB Part Class: Extended Part; Datasheet: https://atta.szlcsc.com/upload/public/pdf/source/20250506/FFB74EDFDFA0AC372CE4A8E4F739CCEF.pdf; Supplier: LCSC; Connector Type: Type-C; Protocol Standard: USB 3.1; Gender: Female; Mounting Type: Surface Mount, Right Angle; Number of Contacts: 16P; Number of Ports: 1; Current Rating-Power: 3A; Voltage Rating: 5V; Connect-Disconnect Life: 5,000 Cycles; Detection color: Black; Operating Temperature: -25℃~+85℃

## Nets
3V3: C2.2 C4.2 CLH1.1 CLH1.2 EXT1.5(VDD) EXT1.11(A0) EXT1.12(A1) EXT1.13(A2) EXT1.14(RESET#) EXT2.5(VDD) EXT2.14(RESET#) LDO1.2(VOUT) LDO1.4(VOUT) PWRH2.1 PWRH2.2 R3.2 R12.2 R13.2 SW3.2 U1.3(3V3)
GND: BATTH1.2 C1.1 C2.1 C3.2 C4.1 C5.1 C7.1 C8.1 CLH1.5 CLH1.6 EXT1.6(VSS) EXT1.7(NC) EXT1.29(EP) EXT2.6(VSS) EXT2.7(NC) EXT2.11(A0) EXT2.12(A1) EXT2.13(A2) EXT2.29(EP) GNDH1.1 GNDH1.2 GNDH1.3 GNDH1.4 GNDH1.5 GNDH1.6 GNDH1.7 GNDH1.8 GNDH1.9 GNDH1.10 GNDH1.11 GNDH1.12 GNDH2.1 GNDH2.2 GNDH2.3 GNDH2.4 GNDH2.5 GNDH2.6 GNDH2.7 GNDH2.8 GNDH2.9 GNDH2.10 GNDH2.11 GNDH2.12 GNDH3.1 GNDH3.2 GNDH3.3 GNDH3.4 GNDH3.5 GNDH3.6 GNDH3.7 GNDH3.8 GNDH3.9 GNDH3.10 GNDH3.11 GNDH3.12 GNDH4.1 GNDH4.2 GNDH4.3 GNDH4.4 GNDH4.5 GNDH4.6 GNDH4.7 GNDH4.8 GNDH4.9 GNDH4.10 GNDH4.11 GNDH4.12 LDO1.1(GND) LEDH1.5 LEDH1.6 PWRH1.1 R1.1 R2.1 R5.1 R6.1 R14.1 RESETH1.2 SW1.1 SW2.2 SW3.5 SW3.6 U1.2(GND) U1.42(GND) U1.43(GND) U1.46(GND) U1.47(GND) U1.48(GND) U1.49(GND) U1.50(GND) U1.51(GND) U1.52(GND) U1.53(GND) U1.54(GND) U1.55(GND) U1.56(GND) U1.57(GND) U1.58(GND) U1.59(GND) U1.60(GND) U1.61(GND) U1.62(GND) U1.63(GND) U1.64(GND) U1.65(GND) U4.1(CTG) U4.4(GND) U4.6(QSTRT) U4.9(EP) U5.4(CE#) U5.6(EN1) U5.8(VSS) U5.14(TMR) U5.17(EP) USB1.1(GND) USB1.12(GND) USB1.13(SHELL) USB1.14(SHELL)
VBAT: BATTH1.1 C5.2 C8.2 U4.2(CELL) U4.3(VDD) U5.2(BAT) U5.3(BAT)
VBUS: C7.2 PWRH1.2 SW3.4 U5.13(IN) USB1.2(VBUS) USB1.11(VBUS)
VIN: C3.1 LDO1.3(VIN) SW3.1 U5.5(EN2) U5.10(OUT) U5.11(OUT)
CHARGING#: CHRGH1.1 U5.9(CHG#)
EN: C1.2 R3.1 RESETH1.1 SW1.2 U1.45(EN)
IO0: SW2.1 U1.4(IO0)
IO35: GPIOH1.8 U1.31(IO35)
IO36: GPIOH1.7 U1.32(IO36)
IO37: GPIOH1.6 U1.33(IO37)
IO39: GPIOH1.5 U1.35(IO39)
IO41: GPIOH1.4 U1.37(IO41)
IO42: GPIOH1.3 U1.38(IO42)
IO47: GPIOH1.10 U1.27(IO47)
IO48: GPIOH1.9 U1.30(IO48)
POT1: CLH1.4 U1.5(IO1)
POT2: CLH1.3 U1.6(IO2)
ROT1A: ROTH1.1 U1.8(IO4)
ROT1B: ROTH1.2 U1.9(IO5)
ROT2A: ROTH1.3 U1.11(IO7)
ROT2B: ROTH1.4 U1.10(IO6)
ROT3A: ROTH1.5 U1.15(IO11)
ROT3B: ROTH1.6 U1.14(IO10)
ROT4A: ROTH1.7 U1.17(IO13)
ROT4B: ROTH1.8 U1.16(IO12)
ROT5A: ROTH2.1 U1.21(IO17)
ROT5B: ROTH2.2 U1.22(IO18)
ROT6A: ROTH2.3 U1.20(IO16)
ROT6B: ROTH2.4 U1.25(IO21)
ROT7A: ROTH2.5 U1.19(IO15)
ROT7B: ROTH2.6 U1.28(IO33)
ROT8A: ROTH2.7 U1.18(IO14)
ROT8B: ROTH2.8 U1.29(IO34)
RX: GPIOH1.1 U1.40(RXD0)
SCL: EXT1.8(SCK) EXT2.8(SCK) R12.1 U1.13(IO9) U4.7(SCL)
SDA: EXT1.9(SDA) EXT2.9(SDA) R13.1 U1.12(IO8) U4.8(SDA)
STRIP1: LEDH1.3 R7.1 U1.36(IO40)
STRIP2: LEDH1.4 R4.1 U1.34(IO38)
TX: GPIOH1.2 U1.39(TXD0)
USB_D+: R8.2 U1.24(IO20)
USB_D-: R9.2 U1.23(IO19)
USB_DN_CONN: R9.1 USB1.5(DN2) USB1.7(DN1)
USB_DP_CONN: R8.1 USB1.6(DP1) USB1.8(DP2)
VLED: LEDH1.1 LEDH1.2 R4.2 R7.2 SW3.3
XGPA0: EXT1.17(GPA0) SWH1.1
XGPA1: EXT1.18(GPA1) SWH1.2
XGPA2: EXT1.19(GPA2) SWH1.3
XGPA3: EXT1.20(GPA3) SWH1.4
XGPA4: EXT1.21(GPA4) SWH1.5
XGPA5: EXT1.22(GPA5) SWH1.6
XGPA6: EXT1.23(GPA6) SWH1.7
XGPA7: EXT1.24(GPA7) SWH1.8
XGPB0: EXT1.25(GPB0) SWH2.1
XGPB1: EXT1.26(GPB1) SWH2.2
XGPB2: EXT1.27(GPB2) SWH2.3
XGPB3: EXT1.28(GPB3) SWH2.4
XGPB4: EXT1.1(GPB4) SWH2.5
XGPB5: EXT1.2(GPB5) SWH2.6
XGPB6: EXT1.3(GPB6) SWH2.7
XGPB7: EXT1.4(GPB7) SWH2.8
YGPA0: EXT2.17(GPA0) SWH4.7
YGPA1: EXT2.18(GPA1) SWH4.8
YGPA2: EXT2.19(GPA2) SWH4.5
YGPA3: EXT2.20(GPA3) SWH4.6
YGPA4: EXT2.21(GPA4) SWH4.3
YGPA5: EXT2.22(GPA5) SWH4.4
YGPA6: EXT2.23(GPA6) SWH4.1
YGPA7: EXT2.24(GPA7) SWH4.2
YGPB0: EXT2.25(GPB0) SWH3.7
YGPB1: EXT2.26(GPB1) SWH3.8
YGPB2: EXT2.27(GPB2) SWH3.5
YGPB3: EXT2.28(GPB3) SWH3.6
YGPB4: EXT2.1(GPB4) SWH3.3
YGPB5: EXT2.2(GPB5) SWH3.4
YGPB6: EXT2.3(GPB6) SWH3.1
YGPB7: EXT2.4(GPB7) SWH3.2
$10N280: R5.2 USB1.4(CC1)
$10N292: R6.2 USB1.10(CC2)
$12N1424: R1.2 U5.1(TS)
$12N1491: R2.2 U5.16(ISET)
$12N6220: R14.2 U5.12(ILIM)

Not connected (* = marked no-connect by the designer): EXT1 10(NC)* 15(INTB)* 16(INTA)*; EXT2 10(NC)* 15(INTB)* 16(INTA)*; U1 1(GND) 7(IO3)* 26(IO26)* 41(IO45)* 44(IO46)*; U4 5(ALRT#)*; U5 7(PGOOD#)* 15(ITERM)*; USB1 3(SBU2)* 9(SBU1)*

## Notes on the sheets
sheet 1
- RESET
- BOOT
- Bootstrap
- Bootstrap
- Bootstrap
- PSRAM
- SPI
- SPI
- SPI
- SPI
- SPI
- SPI
- Notes
- IO26 is not usable in modules with embedded PSRAM.
  Not used to allow the replacement of the ESP32S3 module if required.
- IO3, IO45 and IO46 are bootstrap pins. We avoid any other usage.
- IO0 = Boot button
- All ESP32-S3-Mini modules use QUAD flash/PSRAM, so IO 33-37 are usable.
- USB is assigned to GPIO 19 and 20 and can not be reasigned.
- The primary I2C bus is assigned to GPIO 8 and 8 by default.
sheet 2
- Clutch
- Rotary enc.
- GPIO
sheet 3
- Mounted on the back!!!
sheet 5
- USB-C
- Quote from https://docs.espressif.com/projects/esp-hardware-design-guidelines/en/latest/esp32s3/schematic-checklist.html#usb:
  It is recommended to populate 22/33 ohm series resistors between the mentioned pins and the USB connector.
  Also, reserve a footprint for a capacitor to ground on each trace.
  Note that both components should be placed close to the chip.
sheet 6
- Common GND
sheet 7
- Max. input current: 0.8 to 1.15A
- 1% tolerance
  required
- Termination current set to default 10% of Iset
- Kiset=797 to 975 according to datasheet
- Fast charging current = 300mA (aproximate)
- EN1=0, EN2= 1 ==> Use ILIM
- Thermistor not used
- Battery charger and power path manager
sheet 8
- I2C hardware address 0x07
- I2C hardware address 0x00
sheet 10
- I2C calculations
- https://www.tech-sparks.com/pcb-trace-length/
- https://magellancircuits.com/does-i2c-require-length-matching/
